# EAGLE design N64_RX_V2.1 (EAGLE 7.6.0)
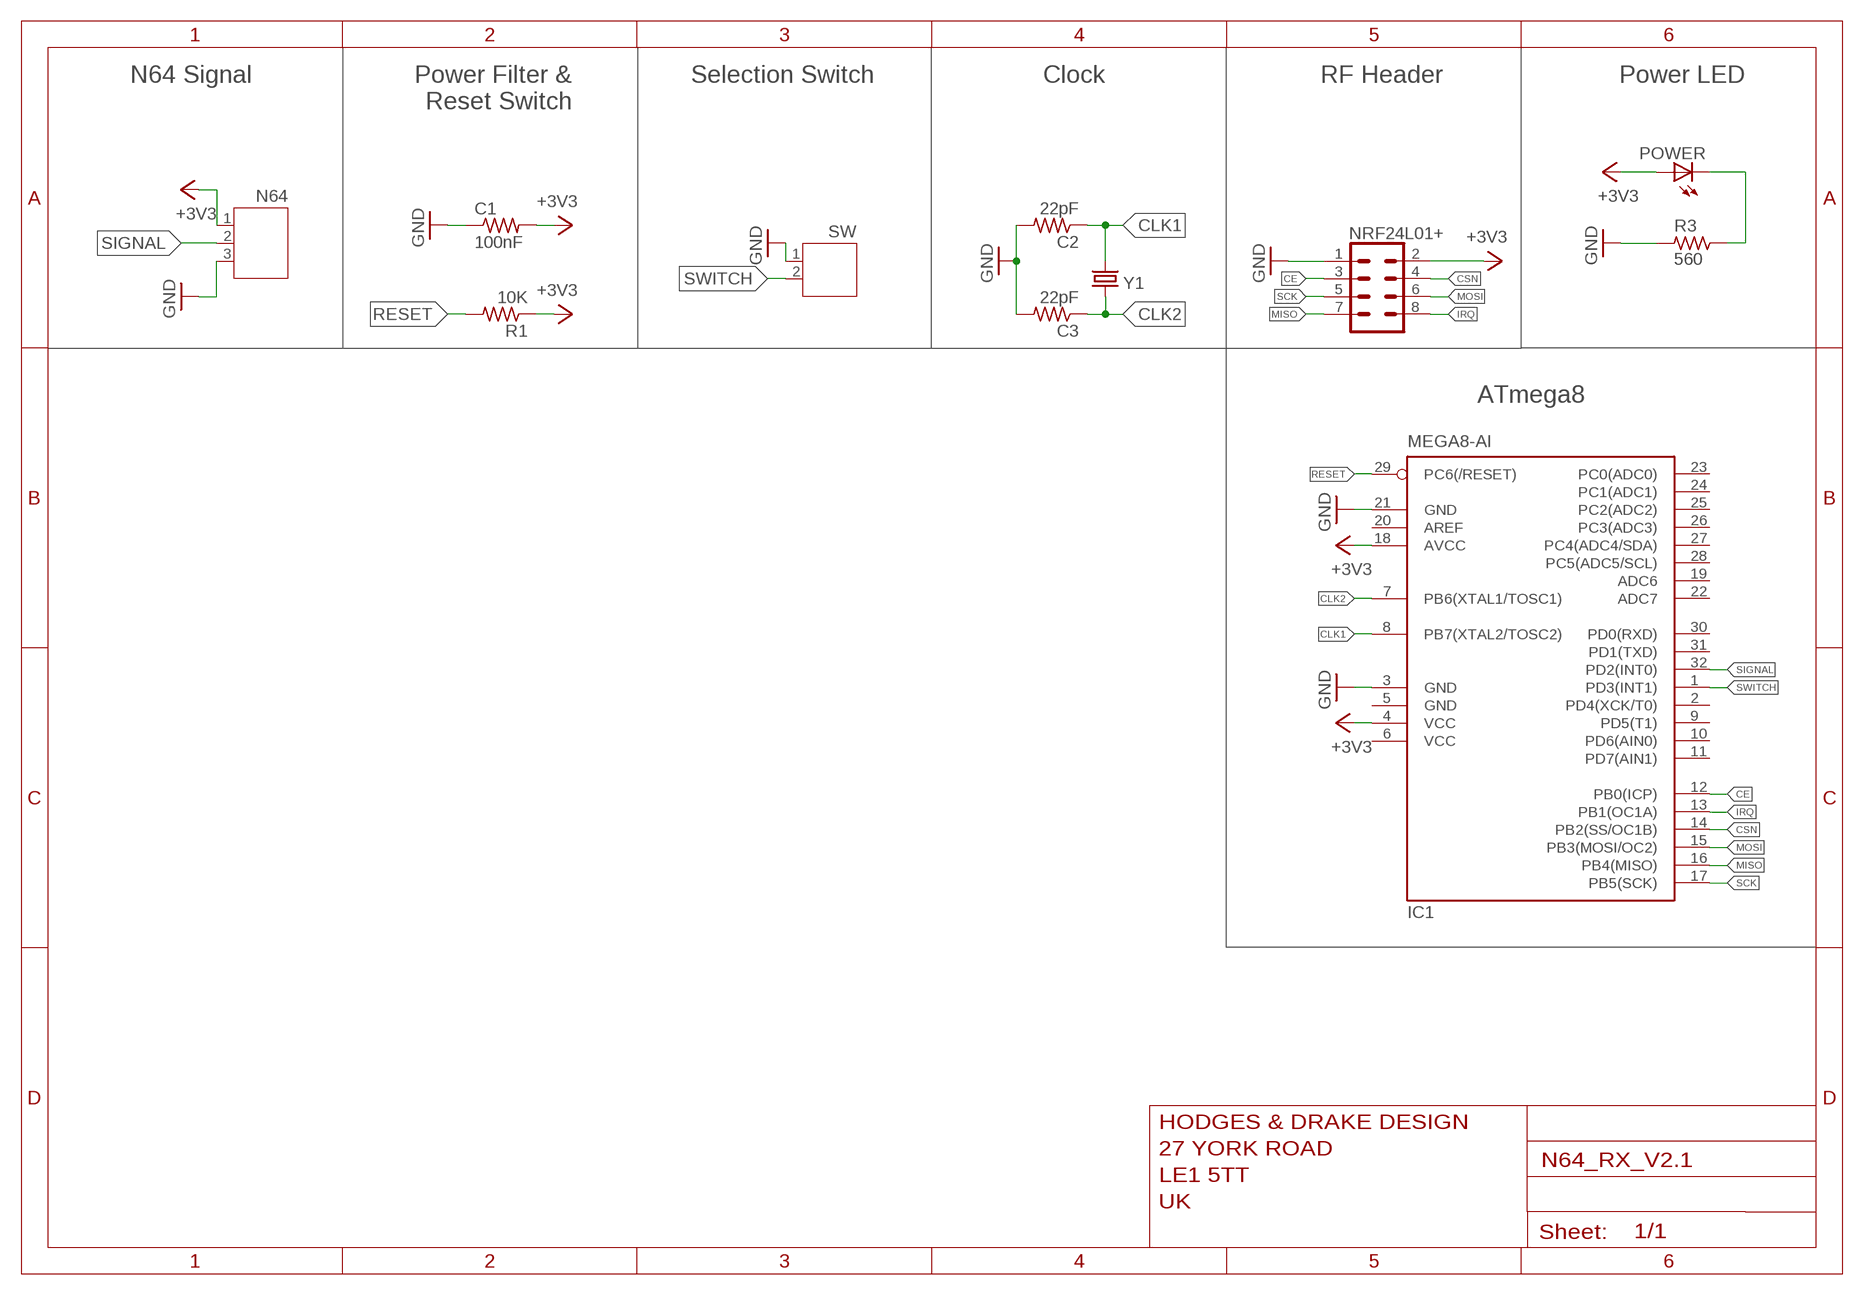
[diagram p0: schematic, sheet 1]

## Parts
C1  100nF  FLIPFLOP-RES  [0805-THM]
C2  22pF  FLIPFLOP-RES  [0805-THM]
C3  22pF  FLIPFLOP-RES  [0805-THM]
IC1  MEGA8-AI  [TQFP32-08]
N64  JST-PH3TH  [JST-PH3]
NRF24L01+  CONN_04X2  [2X4]
POWER  LEDCHIPLED_0805  [CHIPLED_0805]
R1  10K  FLIPFLOP-RES  [0805-THM]
R3  560  R_0805  [R0805]
SW  JST-PH2TH  [JST-PH2]
Y1  CRYSTALHC49S  [HC49/S]

## Nets
+3V3: C1.2 IC1.4(VCC) IC1.18(AVCC) N64.1 NRF24L01+.2 POWER.A R1.1
CE: IC1.12(PB0(ICP)) NRF24L01+.3
CLK1: C2.1 IC1.8(PB7(XTAL2/TOSC2)) Y1.2
CLK2: C3.1 IC1.7(PB6(XTAL1/TOSC1)) Y1.1
CSN: IC1.14(PB2(SS/OC1B)) NRF24L01+.4
GND: C1.1 C2.2 C3.2 IC1.3(GND) IC1.21(GND) N64.3 NRF24L01+.1 R3.1 SW.1
IRQ: IC1.13(PB1(OC1A)) NRF24L01+.8
MISO: IC1.16(PB4(MISO)) NRF24L01+.7
MOSI: IC1.15(PB3(MOSI/OC2)) NRF24L01+.6
N$5: POWER.C R3.2
RESET: IC1.29(PC6(/RESET)) R1.2
SCK: IC1.17(PB5(SCK)) NRF24L01+.5
SIGNAL: IC1.32(PD2(INT0)) N64.2
SWITCH: IC1.1(PD3(INT1)) SW.2
Unconnected: IC1.2(PD4(XCK/T0)) IC1.9(PD5(T1)) IC1.10(PD6(AIN0)) IC1.11(PD7(AIN1)) IC1.19(ADC6) IC1.20(AREF) IC1.22(ADC7) IC1.23(PC0(ADC0)) IC1.24(PC1(ADC1)) IC1.25(PC2(ADC2)) IC1.26(PC3(ADC3)) IC1.27(PC4(ADC4/SDA)) IC1.28(PC5(ADC5/SCL)) IC1.30(PD0(RXD)) IC1.31(PD1(TXD))

## Notes on the sheet
- N64 Signal
- Power Filter &
  Reset Switch
- Selection Switch | Clock | RF Header | Power LED
- ATmega8

## Power pins joined to a net without a drawn wire
GND: IC1.5(GND)
VCC: IC1.6(VCC)

## Library data of the parts
C1-C3 R1 = adafruit:FLIPFLOP-RES: Flip Flop resistor An 0805 resistor inside a standard 1/4W 5% resistor. Makes for easy mods
IC1 = atmel:MEGA8: MICROCONTROLLER 8 Kbytes FLASH, 1 kbytes SRAM, 512 bytes EEPROM, USART, 6-channel 10 bit ADC, 2-channel 8 bit ADC Pin compatible with Atmega48, ATMega88, ATMega168 Source: avr.lbr
N64 = con-jst-ph:JST-PH3
NRF24L01+ = SparkFun-Connectors:CONN_04X2: Multi connection point. Often used as Generic Header-pin footprint for 0.1 inch spaced/style header connections On any of the 0.1 inch spaced packages, you can populate with these: Break Away Headers - Straight <https://www.sparkfun.com/products/116> (PRT-00116) Break Away Male Headers - Right Angle <https://www.sparkfun.com/products/553> (PRT-00553) Female Headers <https://www.sparkfun.com/products/115> (PRT-00115) Break Away Headers - Machine Pin <https://www.sparkfun.com/products/117> (PRT-00117) Break Away Female Headers - Swiss Machine Pin <https://www.sparkfun.com/products/743> (PRT-00743)
POWER = adafruit:LED: LED OSRAM: - CHIPLED LG R971, LG N971, LY N971, LG Q971, LY Q971, LO R971, LY R971 LH N974, LH R974 LS Q976, LO Q976, LY Q976 LO Q996 - Hyper CHIPLED LW Q18S LB Q993, LB Q99A, LB R99A - SideLED LS A670, LO A670, LY A670, LG A670, LP A670 LB A673, LV A673, LT A673, LW A673 LH A674 LY A675 LS A676, LA A676, LO A676, LY A676, LW A676 LS A679, LY A679, LG A679 - Hyper Micro SIDELED® LS Y876, LA Y876, LO Y876, LY Y876 LT Y87S - SmartLED LW L88C, LW L88S LB L89C, LB L89S, LG L890 LS L89K, LO L89K, LY L89K LS L896, LA L896, LO L896, LY L896 - TOPLED LS T670, LO T670, LY T670, LG T670, LP T670 LSG T670, LSP T670, LSY T670, LOP T670, LYG T670 LG T671, LOG T671, LSG T671 LB T673, LV T673, LT T673, LW T673 LH T674 LS T676, LA T676, LO T676, LY T676, LB T676, LH T676, LSB T676, LW T676 LB T67C, LV T67C, LT T67C, LS T67K, LO T67K, LY T67K, LW E67C LS E67B, LA E67B, LO E67B, LY E67B, LB E67C, LV E67C, LT E67C LW T67C LS T679, LY T679, LG T679 LS T770, LO T770, LY T770, LG T770, LP T770 LB T773, LV T773, LT T773, LW T773 LH T774 LS E675, LA E675, LY E675, LS T675 LS T776, LA T776, LO T776, LY T776, LB T776 LHGB T686 LT T68C, LB T68C - Hyper Mini TOPLED® LB M676 - Mini TOPLED Santana® LG M470 LS M47K, LO M47K, LY M47K Source: http://www.osram.convergy.de/
R3 = rc-master-smd:R_: RESISTOR
SW = con-jst-ph:JST-PH2
Y1 = adafruit:CRYSTAL: CRYSTAL; OC_FARNELL: 1667008; OC_NEWARK: unknown

## Board
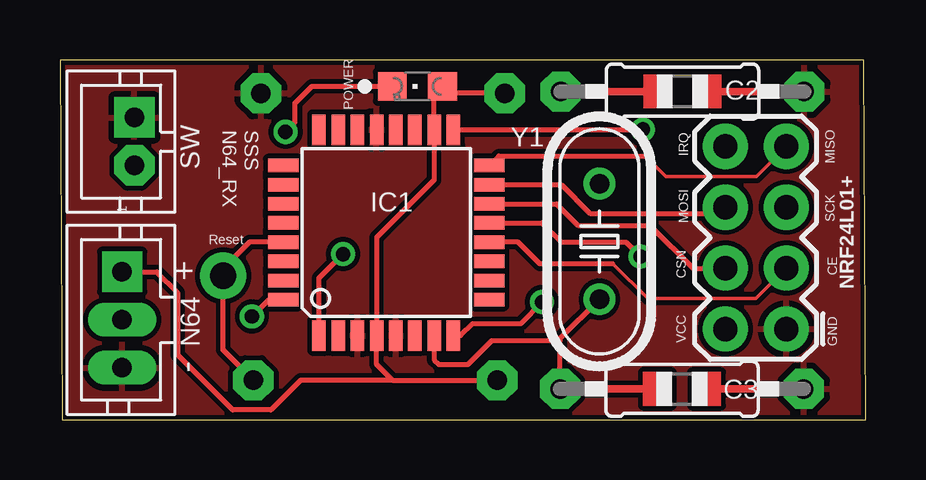
[diagram p1: board, top side]
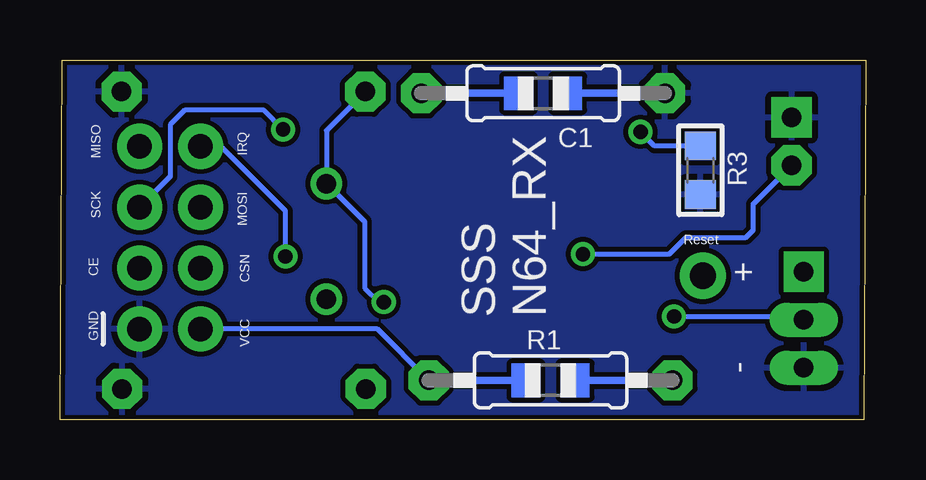
[diagram p2: board, bottom side, seen from below]

Size 33.6 x 15 mm. Coordinates in mm from the lower left corner, seen from the top.
Outline: 0.1,0 33.6,0 33.5,15 0,15 0.1,0
Copper layers (1*16): Top 0.035mm / dielectric 1.5mm / Bottom 0.035mm
Design rules "default *": minimum track width 0.144mm, minimum drill 0.2mm, track to track 8mil, track to pad 8mil, pad to pad 8mil, via to via 8mil, smd to smd 8mil, copper to edge 0.2mm, drill to drill 8mil, minimum pad ring 10mil, minimum via ring 8mil, stop-mask expansion 4mil, vias tented up to drill 0mil, thermal gap 10mil

### Footprints (pad centres in the part's own frame; a part is rotated, then mirrored left to right if it is on the bottom)
0805-THM = drill 0.813 pad 1.676 octagon: 1 -5.08,0; 2 5.08,0
TQFP32-08 = smd 1.27 x 0.559: 1 -4.293,2.8; 2 -4.293,2; 3 -4.293,1.2; 4 -4.293,0.4; 5 -4.293,-0.4; 6 -4.293,-1.2; 7 -4.293,-2; 8 -4.293,-2.8; 17 4.293,-2.8; 18 4.293,-2; 19 4.293,-1.2; 20 4.293,-0.4; 21 4.293,0.4; 22 4.293,1.2; 23 4.293,2; 24 4.293,2.8 | smd 0.559 x 1.27: 9 -2.8,-4.293; 10 -2,-4.293; 11 -1.2,-4.293; 12 -0.4,-4.293; 13 0.4,-4.293; 14 1.2,-4.293; 15 2,-4.293; 16 2.8,-4.293; 25 2.8,4.293; 26 2,4.293; 27 1.2,4.293; 28 0.4,4.293; 29 -0.4,4.293; 30 -1.2,4.293; 31 -2,4.293; 32 -2.8,4.293
JST-PH3 = drill 0.813 pad 1.676 square: 1 1.73,0.508 | drill 0.813 pad 1.422 long: 2 -0.27,0.508; 3 -2.27,0.508
2X4 = drill 1.016 pad 1.88: 1 -3.81,-1.27; 2 -3.81,1.27; 3 -1.27,-1.27; 4 -1.27,1.27; 5 1.27,-1.27; 6 1.27,1.27; 7 3.81,-1.27; 8 3.81,1.27
CHIPLED_0805 = smd 1.2 x 1.2: A 0,-1.05; C 0,1.05
R0805 = smd 1.2 x 1.3: 1 -1.016,0; 2 1.016,0
JST-PH2 = drill 0.813 pad 1.676 square: 1 1,0 | drill 0.813 pad 1.676 octagon: 2 -1,0
HC49/S = drill 0.813: 1 -2.413,0; 2 2.413,0

### Placement (x,y rotation side)
C1  13.46,13.61 180 bottom
C2  25.95,13.68 0 top
C3  25.93,1.28 0 top
IC1  13.6,7.8 90 top
N64  3.1,4.43 90 top
NRF24L01+  29.01,7.59 90 top
POWER  14.9,13.9 90 top
R1  13.15,1.64 0 bottom
R3  6.9,10.4 90 bottom
SW  3.1,11.6 90 top
Y1  22.49,7.43 90 top

### Tracks (layer width: path | path; a pad name or v marks a point on that pad's centre or on a via)
+3V3
  Top 0.2: 13.86,1.64 13.2,2.3 IC1.4 13.2,7.6 15.6,10 IC1.18 15.6,13.55 POWER.A 16.24,13.61 C1.2 | 13.86,1.64 10.04,1.64 8.8,0.4 7.2,0.4 4.9,2.7 4.9,5.3 4.04,6.16 N64.1 | 13.86,1.64 R1.1
  Bottom 0.2: R1.1 20.37,3.78 NRF24L01+.2
CE
  Top 0.154: 23.05,6.5 24.5,5.05 29.01,5.05 NRF24L01+.3
  Top 0.2: 23.05,6.5 20,6.5 19.1,7.4 IC1.12
CLK1  (via drill 0.6)
  Top 0.2: v20.1,4.9 19.2,4 17.2,4 16.71,3.51 IC1.8
  Bottom 0.2: C2.1 22.49,12.06 Y1.2 20.9,8.25 20.9,5.5 20.3,4.9 v20.1,4.9
CLK2
  Top 0.2: C3.1 20.85,3.3 | 20.85,3.3 20.85,3.38 Y1.1 | IC1.7 15.6,2.5 15.8,2.3 17,2.3 18,3.3 20.85,3.3
CSN
  Top 0.2: IC1.14 20.7,9 21.6,8.1 24.6,8.1 26.4,6.3 27.72,6.3 NRF24L01+.4
GND
  pour Bottom: 0.1,0 0,15 33.5,15 33.6,0
  pour Top: 0.1,0 0,15 33.5,15 33.6,0
IRQ  (via drill 0.6)
  Top 0.2: IC1.13 20.1,8.2 20.9,7.4 23.6,7.4 v24.2,6.8
  Bottom 0.2: v24.2,6.8 24.2,8.7 26.9,11.4 NRF24L01+.8
MISO
  Top 0.154: 24.4,11 25.26,10.14 29.02,10.14 NRF24L01+.7
  Top 0.2: IC1.16 18.29,11 24.4,11
MOSI
  Top 0.2: IC1.15 20.9,9.8 22.1,8.6 27.48,8.6 NRF24L01+.6
N$5  (via drill 0.6)
  Top 0.2: v9.4,12 9.8,12.4 9.8,13.2 10.5,13.9 POWER.C
  Bottom 0.2: R3.2 8.82,11.42 v9.4,12
RESET  (via drill 1.1 pad 1.93)
  Top 0.2: IC1.29 7.9,7.4 6.8,6.3 v6.8,6 6.8,2.9 R1.2
SCK  (via drill 0.6)
  Top 0.2: IC1.17 v24.29,12.09 v24.3,12.1
  Bottom 0.2: v24.3,12.1 25.1,12.9 28.4,12.9 29,12.3 29,10.14 NRF24L01+.5
SIGNAL  (via drill 0.6)
  Top 0.2: IC1.32 8.7,5 v8,4.3
  Bottom 0.2: v8,4.3 2.73,4.3 N64.2
SWITCH  (via drill 0.6)
  Top 0.2: IC1.1 10.8,5.9 v11.8,6.9
  Bottom 0.2: v11.8,6.9 8.2,6.9 7.5,7.6 5,7.6 4.7,7.9 4.7,9 SW.2

### Text on the board
tPlace: SSS / N64_RX | MISO | IRQ | SCK | MOSI | + | Reset | CE | CSN | GND | VCC | -
bPlace: IRQ | MISO | MOSI | SCK | + | Reset | CSN | CE | SSS / N64_RX | VCC | GND | -